# Altium schematic sheet MCU_STM32F412VGT6.SchDoc: STM32F412 CNC
size C; Author: AM; CompanyName: Expatria Technologies; DrawnBy: A.Marles; Engineer: AM; Organization: Expatria Technolgoies; Address1: PO Box 2084; Address3: Merritt, BC V1K 1B8; Address4: Canada; DocumentNumber: 5; SheetNumber: 5; SheetTotal: 27
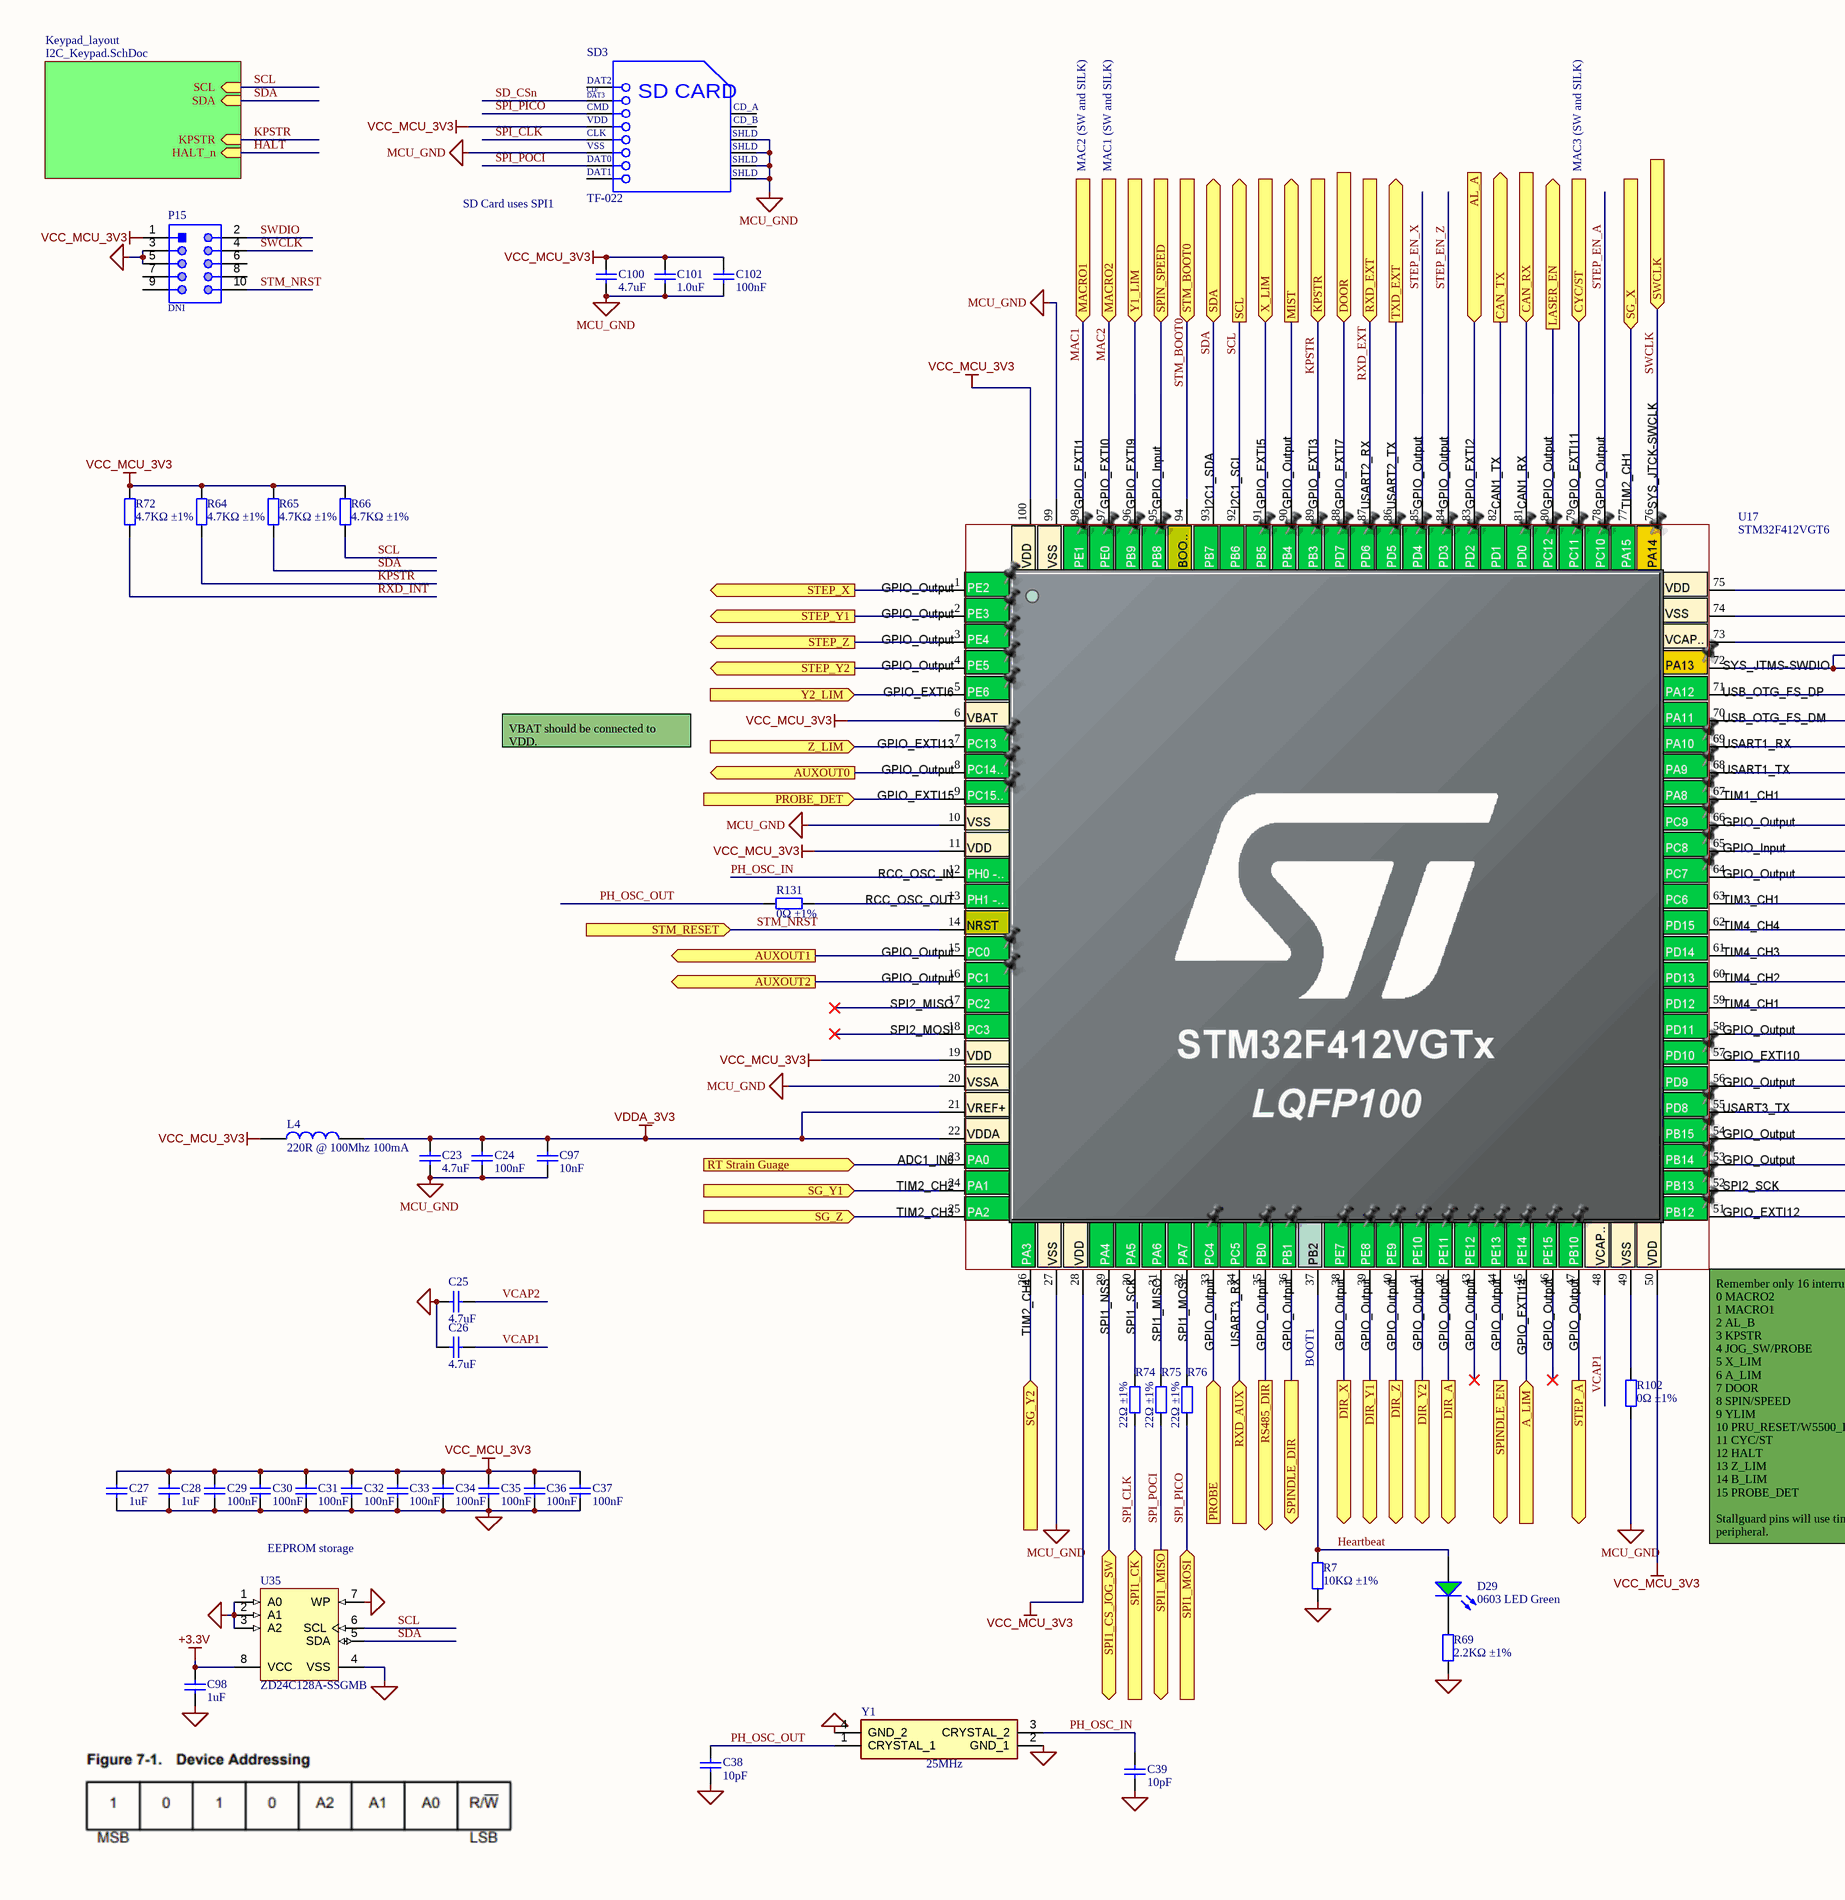
[diagram p0: MCU_STM32F412VGT6.SchDoc, left]
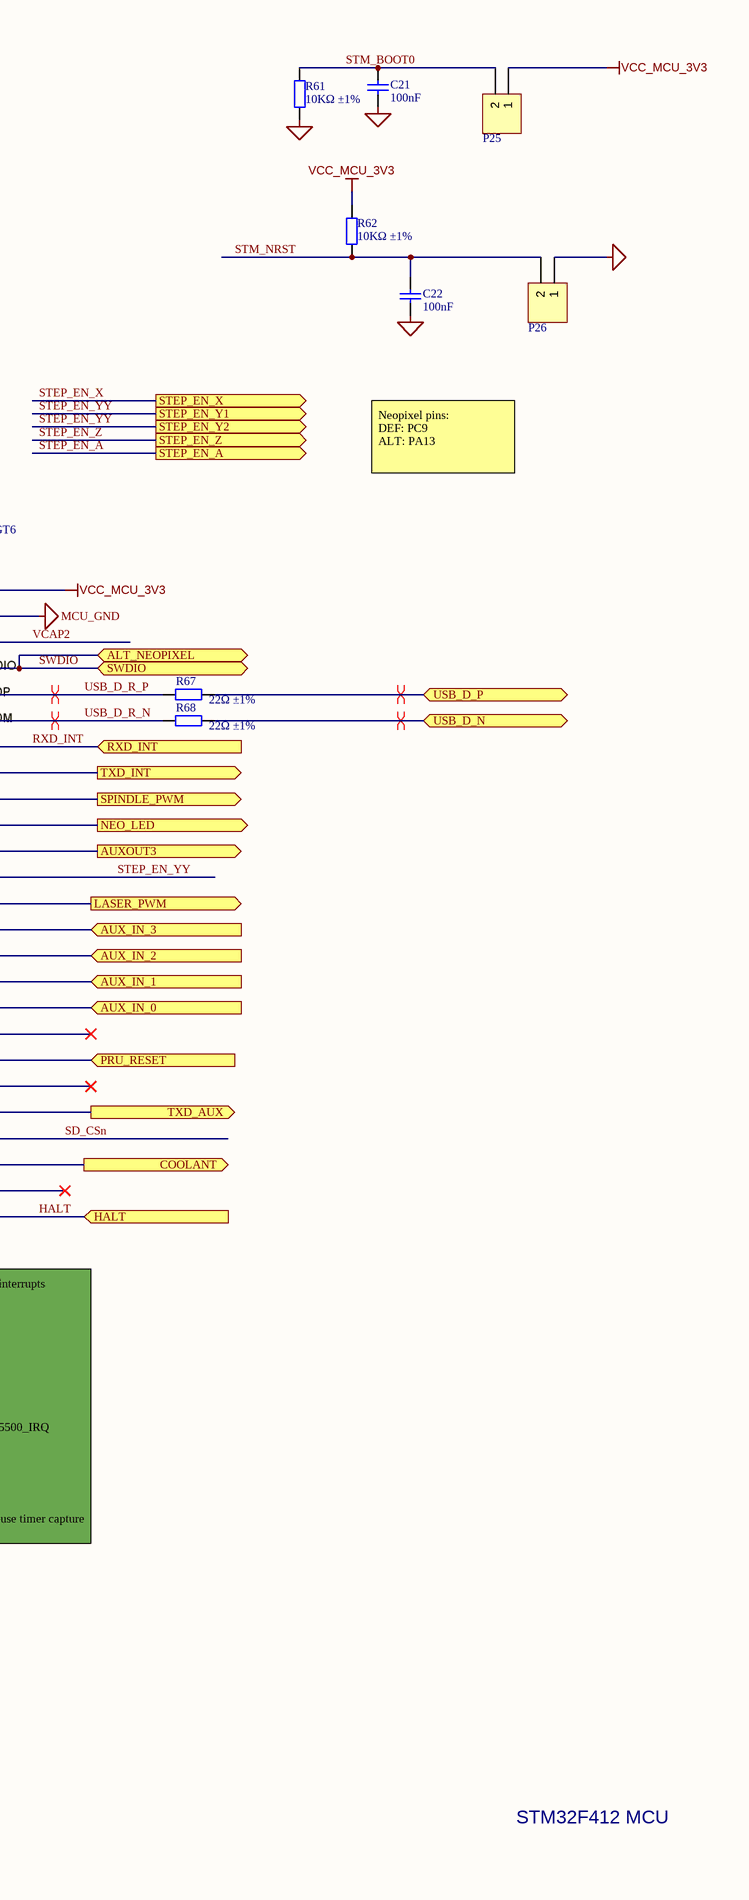
[diagram p1: MCU_STM32F412VGT6.SchDoc, right]

## Parts
C21  100nF  [0402_C]
C22  100nF  [0402_C]
C23  4.7uF  [0603_C]
C24  100nF  [0402_C]
C25  4.7uF  [0603_C]
C26  4.7uF  [0603_C]
C27  1uF  [0603_C]
C28  1uF  [0603_C]
C29  100nF  [0402_C]
C30  100nF  [0402_C]
C31  100nF  [0402_C]
C32  100nF  [0402_C]
C33  100nF  [0402_C]
C34  100nF  [0402_C]
C35  100nF  [0402_C]
C36  100nF  [0402_C]
C37  100nF  [0402_C]
C38  10pF  [0603_C]
C39  10pF  [0603_C]
C97  10nF  [0402_C]
C98  1uF  [0603_C]
C100  4.7uF  [0603_C]
C101  1.0uF  [0402_C]
C102  100nF  [0402_C]
D29  0603 LED Green  [0603_LED_S1 - GREEN]
L4  220R @ 100Mhz 100mA  [0402_L]
P15  DNI  [62201021121]
P25  Header 2  [HDR1X2]  (value not drawn)
P26  Header 2  [HDR1X2]  (value not drawn)
R7  10KΩ ±1%  [0402_R]
R61  10KΩ ±1%  [0402_R]
R62  10KΩ ±1%  [0402_R]
R64  4.7KΩ ±1%  [0402_R]
R65  4.7KΩ ±1%  [0402_R]
R66  4.7KΩ ±1%  [0402_R]
R67  22Ω ±1%  [0603_R]
R68  22Ω ±1%  [0603_R]
R69  2.2KΩ ±1%  [0402_R]
R72  4.7KΩ ±1%  [0402_R]
R74  22Ω ±1%  [0603_R]
R75  22Ω ±1%  [0603_R]
R76  22Ω ±1%  [0603_R]
R102  0Ω ±1%  [0603_R]
R131  0Ω ±1%  [0603_R]
SD3  TF-022  [MOLX-503398-1892_V]
U17  STM32F412VGT6  [QFP50P1600X1600X160-100N]
U35  ZD24C128A-SSGMB  [SOIC-SN8_L]
Y1  value 25MHz  [YSX321SL]  (hidden comment: TAXM25M4RDBCCT2T)

## Sub-sheets
Keypad_layout = I2C_Keypad.SchDoc: SCL (in), SDA (in), KPSTR (in), HALT_n (in)

## Ports
A_LIM (in), AL_A (in), ALT_NEOPIXEL (bidir), AUX_IN_0 (in), AUX_IN_1 (in), AUX_IN_2 (in), AUX_IN_3 (in), AUXOUT0 (out), AUXOUT1 (out), AUXOUT2 (out), AUXOUT3 (out), CAN_RX (in), CAN_TX (out), COOLANT (out), CYC/ST (in), DIR_A (out), DIR_X (out), DIR_Y1 (out), DIR_Y2 (out), DIR_Z (out), DOOR (in), HALT (in), KPSTR (in), LASER_EN (out), LASER_PWM (out), MACRO1 (in), MACRO2 (in), MIST (out), NEO_LED (out), PROBE (in), PROBE_DET (in), PRU_RESET (in), RS485_DIR (out), RT Strain Guage (in), RXD_AUX (in), RXD_EXT (in), RXD_INT (in), SCL (out), SDA (bidir), SG_X (in), SG_Y1 (in), SG_Y2 (in), SG_Z (in), SPI1_CK (in), SPI1_CS_JOG_SW (bidir), SPI1_MISO (out), SPI1_MOSI (in), SPIN_SPEED (in), SPINDLE_DIR (out), SPINDLE_EN (out), SPINDLE_PWM (out), STEP_A (out), STEP_EN_A (out), STEP_EN_X (out), STEP_EN_Y1 (out), STEP_EN_Y2 (out), STEP_EN_Z (out), STEP_X (out), STEP_Y1 (out), STEP_Y2 (out), STEP_Z (out), STM_BOOT0 (in), STM_RESET (in), SWCLK (in), SWDIO (bidir), TXD_AUX (out), TXD_EXT (out), TXD_INT (out), USB_D_N (bidir), USB_D_P (bidir), X_LIM (in), Y1_LIM (in), Y2_LIM (in), Z_LIM (in)

## Nets
+3.3V: C98.2 U35.8(VCC)
MCU_GND: C21.1 C22.1 C23.1 C24.1 C25.1 C26.1 C27.1 C28.1 C29.1 C30.1 C31.1 C32.1 C33.1 C34.1 C35.1 C36.1 C37.1 C38.1 C39.1 C97.1 C98.1 C100.1 C101.1 C102.1 P15.3 P15.5 P26.1 R7.1 R61.2 R69.1 R102.1 SD3.6(VSS) SD3.11(SHLD) SD3.12(SHLD) SD3.13(SHLD) SD3.14(SHLD) U17.10(VSS) U17.20(VSSA) U17.27(VSS) U17.74(VSS) U17.99(VSS) U35.1(A0) U35.2(A1) U35.3(A2) U35.4(VSS) U35.7(WP) Y1.2(GND_1) Y1.4(GND_2)
VCC_MCU_3V3: C27.2 C28.2 C29.2 C30.2 C31.2 C32.2 C33.2 C34.2 C35.2 C36.2 C37.2 C100.2 C101.2 C102.2 L4.1 P15.1 P25.1 R62.1 R64.2 R65.2 R66.2 R72.2 SD3.4(VDD) U17.6(VBAT) U17.11(VDD) U17.19(VDD) U17.28(VDD) U17.50(VDD) U17.75(VDD) U17.100(VDD)
VDDA_3V3: C23.2 C24.2 C97.2 L4.2 U17.21(VREF+) U17.22(VDDA)
A_LIM: U17.45(PE14) ; port A_LIM
AL_A: U17.83(PD2) ; port AL_A
AUX_IN_0: U17.59(PD12) ; port AUX_IN_0
AUX_IN_1: U17.60(PD13) ; port AUX_IN_1
AUX_IN_2: U17.61(PD14) ; port AUX_IN_2
AUX_IN_3: U17.62(PD15) ; port AUX_IN_3
AUXOUT0: U17.8(PC14) ; port AUXOUT0
AUXOUT1: U17.15(PC0) ; port AUXOUT1
AUXOUT2: U17.16(PC1) ; port AUXOUT2
AUXOUT3: U17.65(PC8) ; port AUXOUT3
CAN_RX: U17.81(PD0) ; port CAN_RX
CAN_TX: U17.82(PD1) ; port CAN_TX
COOLANT: U17.53(PB14) ; port COOLANT
CYC/ST: U17.79(PC11) ; port CYC/ST
DIR_A: U17.42(PE11) ; port DIR_A
DIR_X: U17.38(PE7) ; port DIR_X
DIR_Y1: U17.39(PE8) ; port DIR_Y1
DIR_Y2: U17.41(PE10) ; port DIR_Y2
DIR_Z: U17.40(PE9) ; port DIR_Z
DOOR: U17.88(PD7) ; port DOOR
HALT: U17.51(PB12) ; port HALT, sheet Keypad_layout/HALT_n
Heartbeat: D29.A R7.2 U17.37(PB2)
KPSTR: R64.1 U17.89(PB3) ; port KPSTR, sheet Keypad_layout/KPSTR
LASER_EN: U17.80(PC12) ; port LASER_EN
LASER_PWM: U17.63(PC6) ; port LASER_PWM
MAC1: U17.98(PE1) ; port MACRO1
MAC2: U17.97(PE0) ; port MACRO2
MIST: U17.90(PB4) ; port MIST
NEO_LED: U17.66(PC9) ; port NEO_LED
PH_OSC_IN: C39.2 U17.12(PH0) Y1.3(CRYSTAL_2)
PH_OSC_OUT: C38.2 R131.2 Y1.1(CRYSTAL_1)
PROBE: U17.33(PC4) ; port PROBE
PROBE_DET: U17.9(PC15) ; port PROBE_DET
PRU_RESET: U17.57(PD10) ; port PRU_RESET
RS485_DIR: U17.35(PB0) ; port RS485_DIR
RT Strain Guage: U17.23(PA0) ; port RT Strain Guage
RXD_AUX: U17.34(PC5) ; port RXD_AUX
RXD_EXT: U17.87(PD6) ; port RXD_EXT
RXD_INT: R72.1 U17.69(PA10) ; port RXD_INT
SCL: R66.1 U17.92(PB6) U35.6(SCL) ; port SCL, sheet Keypad_layout/SCL
SD_CSn: SD3.2(CD/DAT3) U17.54(PB15)
SDA: R65.1 U17.93(PB7) U35.5(SDA) ; port SDA, sheet Keypad_layout/SDA
SG_X: U17.77(PA15) ; port SG_X
SG_Y1: U17.24(PA1) ; port SG_Y1
SG_Y2: U17.26(PA3) ; port SG_Y2
SG_Z: U17.25(PA2) ; port SG_Z
SPI1_CS_JOG_SW: U17.29(PA4) ; port SPI1_CS_JOG_SW
SPI_CLK: R74.2 SD3.5(CLK) ; port SPI1_CK
SPI_PICO: R76.2 SD3.3(CMD) ; port SPI1_MOSI
SPI_POCI: R75.2 SD3.7(DAT0) ; port SPI1_MISO
SPIN_SPEED: U17.95(PB8) ; port SPIN_SPEED
SPINDLE_DIR: U17.36(PB1) ; port SPINDLE_DIR
SPINDLE_EN: U17.44(PE13) ; port SPINDLE_EN
SPINDLE_PWM: U17.67(PA8) ; port SPINDLE_PWM
STEP_A: U17.47(PB10) ; port STEP_A
STEP_EN_A: U17.78(PC10) ; port STEP_EN_A
STEP_EN_X: U17.85(PD4) ; port STEP_EN_X
STEP_EN_YY: U17.64(PC7) ; port STEP_EN_Y1, port STEP_EN_Y2
STEP_EN_Z: U17.84(PD3) ; port STEP_EN_Z
STEP_X: U17.1(PE2) ; port STEP_X
STEP_Y1: U17.2(PE3) ; port STEP_Y1
STEP_Y2: U17.4(PE5) ; port STEP_Y2
STEP_Z: U17.3(PE4) ; port STEP_Z
STM_BOOT0: C21.2 P25.2 R61.1 U17.94(BOOT0) ; port STM_BOOT0
STM_NRST: C22.2 P15.10 P26.2 R62.2 U17.14(NRST) ; port STM_RESET
SWCLK: P15.4 U17.76(PA14) ; port SWCLK
SWDIO: P15.2 U17.72(PA13) ; port SWDIO, port ALT_NEOPIXEL
TXD_AUX: U17.55(PD8) ; port TXD_AUX
TXD_EXT: U17.86(PD5) ; port TXD_EXT
TXD_INT: U17.68(PA9) ; port TXD_INT
USB_D_N: R68.2 ; port USB_D_N
USB_D_P: R67.2 ; port USB_D_P
USB_D_R_N: R68.1 U17.70(PA11)
USB_D_R_P: R67.1 U17.71(PA12)
VCAP1: C26.2 U17.48(VCAP1)
VCAP2: C25.2 U17.73(VCAP2)
X_LIM: U17.91(PB5) ; port X_LIM
Y1_LIM: U17.96(PB9) ; port Y1_LIM
Y2_LIM: U17.5(PE6) ; port Y2_LIM
Z_LIM: U17.7(PC13) ; port Z_LIM
NetD29_K: D29.K R69.2
NetR74_1: R74.1 U17.30(PA5)
NetR75_1: R75.1 U17.31(PA6)
NetR76_1: R76.1 U17.32(PA7)
NetR102_2: R102.2 U17.49(VSS)
NetR131_1: R131.1 U17.13(PH1)

Not connected (* = marked no-connect by the designer): P15 6 7 8 9; SD3 1(DAT2) 8(DAT1) 9(CD_A) 10(CD_B); U17 17(PC2)* 18(PC3)* 43(PE12)* 46(PE15)* 52(PB13)* 56(PD9)* 58(PD11)*

## Layout directives
differential pair: USB_D_N, USB_D_P, USB_D_R_N, USB_D_R_P

## Notes on the sheet
- SD Card uses SPI1
- MAC2 (SW and SILK)
- MAC1 (SW and SILK)
- MAC3 (SW and SILK)
- Neopixel pins:
  DEF: PC9
  ALT: PA13
- VBAT should be connected to VDD.
- BOOT1
- EEPROM storage
- (near U17) Remember only 16 interrupts
  0 MACRO2
  1 MACRO1
  2 AL_B
  3 KPSTR
  4 JOG_SW/PROBE
  5 X_LIM
  6 A_LIM
  7 DOOR
  8 SPIN/SPEED
  9 YLIM
  10 PRU_RESET/W5500_IRQ
  11 CYC/ST
  12 HALT
  13 Z_LIM
  14 B_LIM
  15 PROBE_DET
  Stallguard pins will use timer capture peripheral.
- STM32F412 MCU
- Expatria Technologies
- SHEET
- PROJECT
- REV
- EMAIL: INFO@EXPATRIA.CA
- 625 Kane Valley Rd.
- Box 2084
- Merritt, BC V1K1B8
- SIZE
- ENGR
- C
- MODIFIED
- DOCUMENT
- /
- Copyright Sienci Labs 2024. This document describes Open Hardware and is licensed under the CERN-OHL-S v2. No warranty is implied or expressed.
- (in symbol TF-022) CD/; DAT3; SD CARD

## Library data of the parts
C21 C22 C24 C29-C37 C102 = 0402 100nF (104) 10% 16V: 16V 100nF X7R ±10% 0402 Multilayer Ceramic Capacitors MLCC - SMD/SMT ROHS; Manufacturer: Samsung Electro-Mechanics; Manufacturer Part Number: CL05B104KO5NNNC; ComponentLink1Description: Supplier link; ComponentLink1URL: http://www.szlcsc.com/product/details_1877.html; Package: 0402; Supplier: LC; SuppliersPartNumber: C1525; Capacitance: 100nF; Tolerance: 10%; Voltage: 16V
C23 C25 C26 C100 = 0603 4.7uF (475) 10% 16V: 16V 4.7uF X5R ±10% 0603 Multilayer Ceramic Capacitors MLCC - SMD/SMT ROHS; Manufacturer: Samsung Electro-Mechanics; Manufacturer Part Number: CL10A475KO8NNNC; ComponentLink1Description: Supplier link; ComponentLink1URL: http://www.szlcsc.com/product/details_20375.html; Package: 0603; Supplier: LC; SuppliersPartNumber: C19666; Capacitance: 4.7uF; Tolerance: 10%; Voltage: 16V
C27 C28 C98 = 0603 1uF (105) 10% 50V: Chip capacitors; Manufacturer: Samsung Electro-Mechanics; Manufacturer Part Number: CL10A105KB8NNNC; Tolerance: 10%; Voltage: 50V; ComponentLink1Description: Supplier link; ComponentLink1URL: http://www.szlcsc.com/product/details_16531.html; Package: 0603; Supplier: LCSC; SuppliersPartNumber: C15849; Capacitance: 1uF
C38 C39 = 0603 10pF (100) 5% 50V: Chip capacitors; Manufacturer: Samsung Electro-Mechanics; Manufacturer Part Number: CL10C100JB8NNNC; Tolerance: 5%; Voltage: 50V; ComponentLink1Description: Supplier link; ComponentLink1URL: http://www.szlcsc.com/product/details_1986.html; Package: 0603; Supplier: LCSC; SuppliersPartNumber: C1634; Capacitance: 10pF
C97 = 0402 10nF (103) 10% 50V: Chip capacitors; Manufacturer: Samsung Electro-Mechanics; Manufacturer Part Number: CL05B103KB5NNNC; Tolerance: 10%; Voltage: 50V; ComponentLink1Description: Supplier link; ComponentLink1URL: http://www.szlcsc.com/product/details_15869.html; Package: 0402; Supplier: LC; SuppliersPartNumber: C15195; Capacitance: 10nF
C101 = 0402 1.0uF (105) 10% 25V: Chip capacitor; Manufacturer: Samsung Electro-Mechanics; Manufacturer Part Number: CL05A105KA5NQNC; Capacitance: 1uF; Tolerance: 10%; Voltage: 25V; ComponentLink1Description: Supplier link; ComponentLink1URL: http://www.szlcsc.com/product/details_53938.html; Package: 0402; Supplier: LC; SuppliersPartNumber: C52923
D29 = MHT192UGCT: 20mA -40℃~+85℃ 515nm~530nm Emerald 120° 60mW 0603 Light Emitting Diodes (LED) ROHS; Manufacturer: MEIHUA; Package: 0603; Supplier: LC; SuppliersPartNumber: C389519; Color: Green; Manufacturer Part Number: MHT192UGCT
L4 = 0402 220R@100Mhz 0.1A: 700mΩ ±25% 220Ω@100MHz 0402 Ferrite Beads ROHS; Manufacturer Part Number: CBG100505U221T; Manufacturer: FH (Guangdong Fenghua Advanced Tech); Package: 0402; Supplier: LC; SuppliersPartNumber: C92617
P15 = B-2101S10P-B110: Straight Square Pins 1mm 10P 3mm -40℃~+105℃ 1.8mm 1.27mm Black 1.27mm 2x5P Plugin,P=1.27mm Pin Headers ROHS; Manufacturer: Ckmtw(Shenzhen Cankemeng); Manufacturer Part Number: B-2101S10P-B110; Supplier 1: LCSC; SuppliersPartNumber: C2895038; RoHS: No
P25 P26 = Header 2: Straight Square Pins 2 2.54mm Black Brass 1x2P Plugin,P=2.54mm Pin Headers ROHS; Manufacturer: MOLEX; Manufacturer Part Number: 22284020; Publisher: Altium Limited; LatestRevisionDate: 17-Jul-2002; LatestRevisionNote: Re-released for DXP Platform.; SuppliersPartNumber: C234182; Supplier 1: LCSC; Supplier Part Number 1: C234182
R7 R61 R62 = 0402 10K (1002) 1%: Chip resistor; Manufacturer: Uniroyal Elec; Manufacturer Part Number: 0402WGF1002TCE; Power: 1/16W; ComponentLink1Description: Supplier link; ComponentLink1URL: http://www.szlcsc.com/product/details_26487.html; Package: 0402; Supplier: LC; SuppliersPartNumber: C25744; Resistance: 10KΩ; Tolerance: 1%
R64-R66 R72 = 0402 4.7K (4701) 1%: Chip resistor; Manufacturer: Uniroyal Elec; Manufacturer Part Number: 0402WGF4701TCE; Power: 1/16W; ComponentLink1Description: Supplier link; ComponentLink1URL: http://www.szlcsc.com/product/details_26643.html; Package: 0402; Supplier: LC; SuppliersPartNumber: C25900; Resistance: 4.7KΩ; Tolerance: 1%
R67 R68 R74-R76 = 0603 22R (22R0) 1%: Chip resistor; Manufacturer: Uniroyal Elec; Manufacturer Part Number: 0603WAF220JT5E; Power: 1/10W; ComponentLink1Description: Supplier link; ComponentLink1URL: http://www.szlcsc.com/product/details_24078.html; Package: 0603; Supplier: LCSC; SuppliersPartNumber: C23345; Resistance: 22Ω; Tolerance: 1%
R69 = 0402 2.2K (2201) 1%: Chip resistor; Manufacturer: Uniroyal Elec; Manufacturer Part Number: 0402WGF2201TCE; Power: 1/16W; ComponentLink1Description: Supplier link; ComponentLink1URL: http://www.szlcsc.com/product/details_26622.html; Package: 0402; Supplier: LC; SuppliersPartNumber: C25879; Resistance: 2.2KΩ; Tolerance: 1%
R102 R131 = 0603 0R (0R0) 1%: Chip resistor; Manufacturer: Uniroyal Elec; Manufacturer Part Number: 0603WAF0000T5E; Power: 1/10W; ComponentLink1Description: Supplier link; ComponentLink1URL: http://www.szlcsc.com/product/details_21903.html; Package: 0603; Supplier: LC; SuppliersPartNumber: C21189; Resistance: 0Ω; Tolerance: 1%
SD3 = TF-022: -40℃~+85℃ 1.28mm Gold plating Deck MicroSD card (TF card) Self bomb SMD SD Card Connectors ROHS; Manufacturer: Hanbo Electronic; SuppliersPartNumber: C2962373; Manufacturer Part Number: TF-022; Value: TF-022
U17 = STM32F412VGT6: LQFP-100(14x14) Microcontroller Units (MCUs/MPUs/SOCs) ROHS; Manufacturer: STMicroelectronics; Height: 1.6mm; Datasheet Link: https://4donline.ihs.com/images/VipMasterIC/IC/SGST/SGST-S-A0004202317/SGST-S-A0004202317-1.pdf?hkey=6D3A4C79FDBF58556ACFDE234799DDF0; Manufacturer_Part_Number: STM32F412VGT6; SuppliersPartNumber: C727951; Supplier: LCSC; Manufacturer Part Number: STM32F412VGT6; Value: STM32F412VGT6
U35 = CMP-0159-00216-1: IC EEPROM 128KBIT I2C 8SOIC; Manufacturer: Zetta; SuppliersPartNumber: C918271; Manufacturer Part Number: ZD24C128A-SSGMB
Y1 = TAXM25M4RDBCCT2T: 25MHz 10pF ±10ppm SMD3225-4P Crystals ROHS; Manufacturer_Name: TAE(Zhejiang Abel Elec); Height: 0.8mm; Manufacturer_Part_Number: TAXM25M4RDBCCT2T; SuppliersPartNumber: C403946; Supplier 1: LCSC; Supplier Part Number 1: C403946; Manufacturer 1: TAE(Zhejiang Abel Elec); Manufacturer Part Number 1: TAXM25M4RDBCCT2T; Manufacturer: TAE(Zhejiang Abel Elec); Manufacturer Part Number: TAXM25M4RDBCCT2T